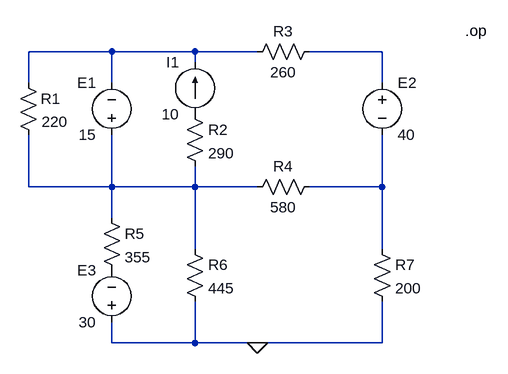
[diagram p0: schematic Симуляция схемы.asc]
Симуляция схемы.asc, the LTspice schematic file:
Version 4
SHEET 1 880 680
WIRE 160 64 32 64
WIRE 288 64 160 64
WIRE 384 64 288 64
WIRE 576 64 464 64
WIRE 288 80 288 64
WIRE 32 112 32 64
WIRE 160 112 160 64
WIRE 576 112 576 64
WIRE 32 272 32 192
WIRE 160 272 160 192
WIRE 160 272 32 272
WIRE 288 272 288 240
WIRE 288 272 160 272
WIRE 384 272 288 272
WIRE 576 272 576 192
WIRE 576 272 464 272
WIRE 160 320 160 272
WIRE 288 368 288 272
WIRE 576 368 576 272
WIRE 160 512 160 480
WIRE 288 512 288 448
WIRE 288 512 160 512
WIRE 384 512 288 512
WIRE 576 512 576 448
WIRE 576 512 384 512
FLAG 384 512 0
SYMBOL res 16 96 R0
WINDOW 0 35 40 Left 2
SYMATTR InstName R1
SYMATTR Value 220
SYMBOL current 288 160 R180
WINDOW 0 24 80 Left 2
WINDOW 3 24 0 Left 2
SYMATTR InstName I1
SYMATTR Value 10
SYMBOL res 272 144 R0
SYMATTR InstName R2
SYMATTR Value 290
SYMBOL voltage 160 208 R180
WINDOW 0 24 96 Left 2
WINDOW 3 24 16 Left 2
SYMATTR InstName E1
SYMATTR Value 15
SYMBOL res 480 48 R90
WINDOW 0 0 56 VBottom 2
WINDOW 3 32 56 VTop 2
SYMATTR InstName R3
SYMATTR Value 260
SYMBOL res 480 256 R90
WINDOW 0 0 56 VBottom 2
WINDOW 3 32 56 VTop 2
SYMATTR InstName R4
SYMATTR Value 580
SYMBOL voltage 576 96 R0
SYMATTR InstName E2
SYMATTR Value 40
SYMBOL res 560 352 R0
SYMATTR InstName R7
SYMATTR Value 200
SYMBOL res 272 352 R0
SYMATTR InstName R6
SYMATTR Value 445
SYMBOL res 144 304 R0
SYMATTR InstName R5
SYMATTR Value 355
SYMBOL voltage 160 496 R180
WINDOW 0 24 96 Left 2
WINDOW 3 24 16 Left 2
SYMATTR InstName E3
SYMATTR Value 30
TEXT 704 32 Left 2 !.op

The netlist it stands for:
* Симуляция схемы.asc
R1 N001 N003 220
I1 P001 N001 10
R2 P001 N003 290
V§E1 N003 N001 15
R3 N002 N001 260
R4 N004 N003 580
V§E2 N002 N004 40
R7 N004 0 200
R6 N003 0 445
R5 N003 P002 355
V§E3 0 P002 30
.op
.backanno
.end